# EAGLE design sqm-b411-7 (EAGLE 6.4)
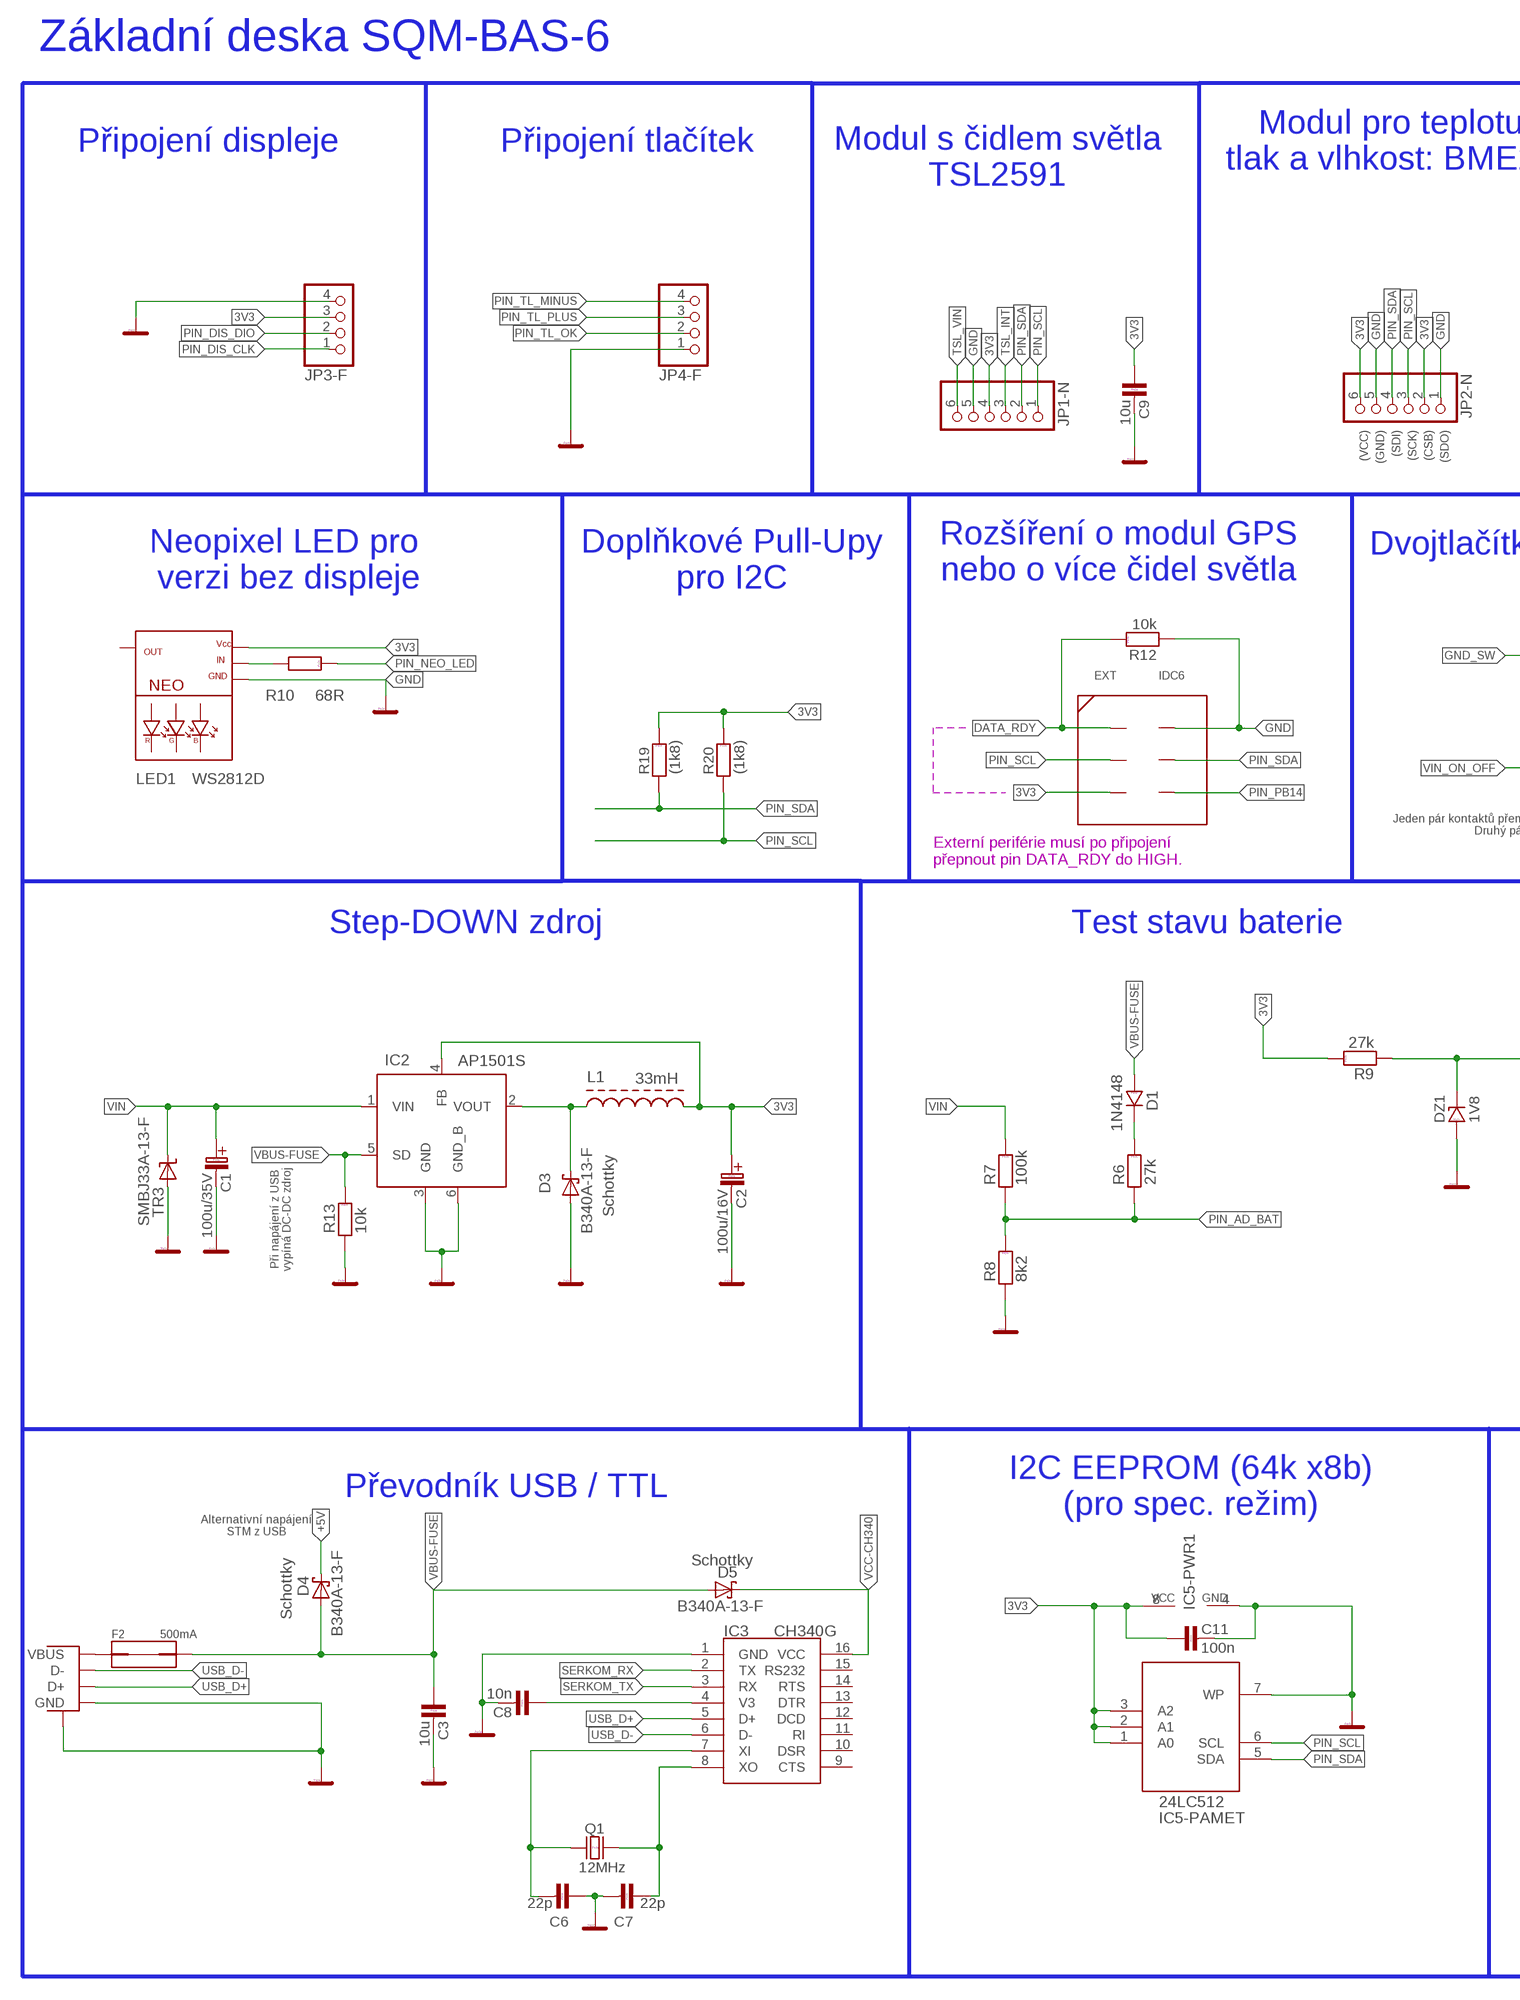
[diagram p0: schematic, sheet 1, part 1 of 2]
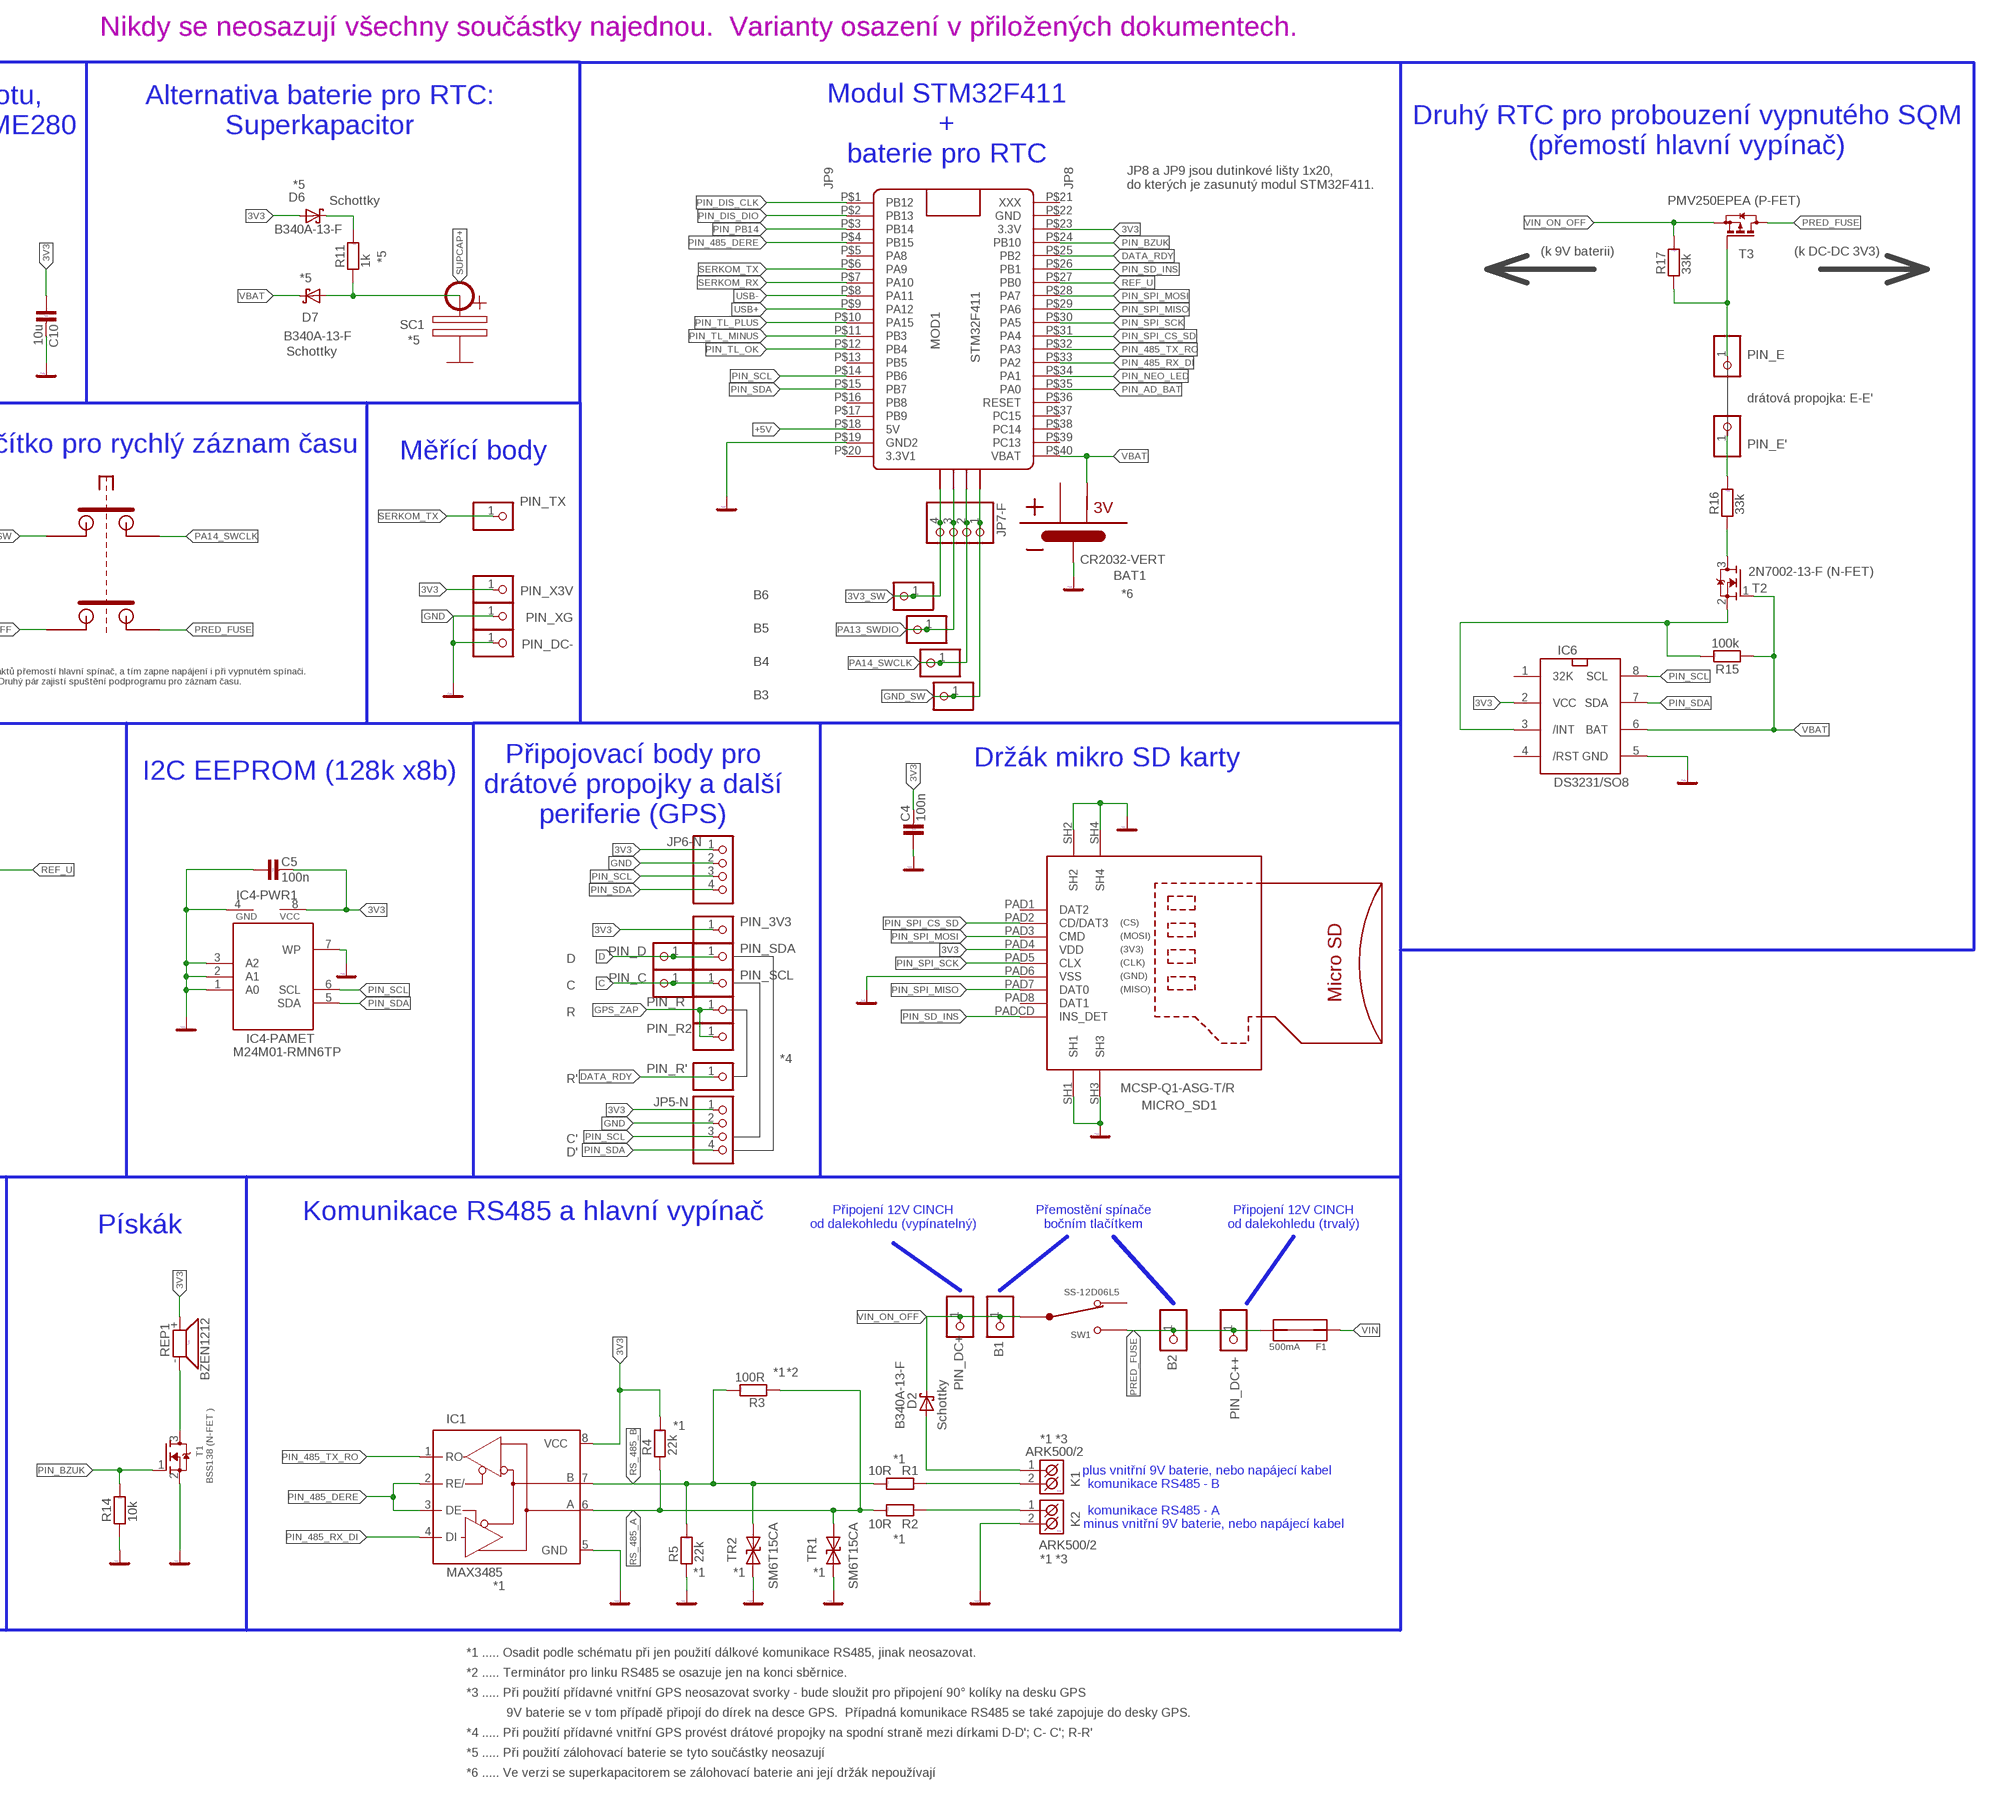
[diagram p1: schematic, sheet 1, part 2 of 2]

## Parts
B1  PINHD-1X1  [1X01]
B2  PINHD-1X1  [1X01]
B3  PINHD-1X1  [1X01]
B4  PINHD-1X1  [1X01]
B5  PINHD-1X1  [1X01]
B6  PINHD-1X1  [1X01]
BAT1  CR2032-VERT  [CR2032-VERT]
C1  100u/35V  C-ELEKTROLYT_3,5  [C-EL_3,5]
C2  100u/16V  C-ELEKTROLYT_3,5  [C-EL_3,5]
C3  10u  C-KERAMIK_SMD_0805  [0805]
C4  100n  C-KERAMIK_SMD_0805  [0805]
C5  100n  C-KERAMIK_SMD_0805  [0805]
C6  22p  C-KERAMIK_SMD_0805  [0805]
C7  22p  C-KERAMIK_SMD_0805  [0805]
C8  10n  C-KERAMIK_SMD_0805  [0805]
C9  10u  C-KERAMIK_SMD_0805  [0805]
C10  10u  C-KERAMIK_SMD_0805  [0805]
C11  100n  C-KERAMIK_SMD_0805  [0805]
D1  1N4148  1N4148_SOD80  [SOD-80]
D2  B340A-13-F  SCHOTTKY-DIODESMD  [SMB]
D3  B340A-13-F  SCHOTTKY-DIODESMD  [SMB]
D4  B340A-13-F  SCHOTTKY-DIODESMD  [SMB]
D5  B340A-13-F  SCHOTTKY-DIODESMD  [SMB]
D6  B340A-13-F  SCHOTTKY-DIODESMD  [SMB]
D7  B340A-13-F  SCHOTTKY-DIODESMD  [SMB]
DZ1  1V8  D-ZENEROVA_0,5W_BZV55C_SMD  [SOD-80]
EXT  IDC6  [IDC6]
F1  500mA  FUSE1812  [FUSE1812]
F2  500mA  FUSE1812  [FUSE1812]
IC1  MAX3485  MAX3468ESA  [SO08]
IC2  AP1501S  [TO263-5]
IC3  CH340G  [SOIC16]
IC4  M24M01-RMN6TP  EEPROM  [SO8]
IC5  24LC512  EEPROM  [SO8]
IC6  DS3231/SO8  RTC  [SO8]
JP1-N  PINHD-1X6  [1X06]
JP2-N  PINHD-1X6  [1X06]
JP3-F  PINHD-1X4  [1X04]
JP4-F  PINHD-1X4  [1X04]
JP5-N  PINHD-1X4  [1X04]
JP6-N  PINHD-1X4  [1X04]
JP7-F  PINHD-1X4  [1X04]
K1  ARK500/2  [ARK500/2]
K2  ARK500/2  [ARK500/2]
L1  33mH  SMD_INDUCTOR  [SMD_INDUCTOR]
LED1  WS2812D  LED_RGB  [LED_5-RGB]
MICRO_SD1  MCSP-Q1-ASG-T/R  MICRO_SD_MCSP_Q1_A_SG_T_R  [MICRO_SD]
MOD1  STM32F411  BLACK411_PILL  [BLACK411_PILL]
PIN_3V3  PINHD-1X1  [1X01]
PIN_C  PINHD-1X1  [1X01]
PIN_D  PINHD-1X1  [1X01]
PIN_DC+  PINHD-1X1  [1X01]
PIN_DC++  PINHD-1X1  [1X01]
PIN_DC-  PINHD-1X1  [1X01]
PIN_E  PINHD-1X1  [1X01]
PIN_E'  PINHD-1X1  [1X01]
PIN_R  PINHD-1X1  [1X01]
PIN_R2  PINHD-1X1  [1X01]
PIN_R'  PINHD-1X1  [1X01]
PIN_SCL  PINHD-1X1  [1X01]
PIN_SDA  PINHD-1X1  [1X01]
PIN_TX  PINHD-1X1  [1X01]
PIN_X3V  PINHD-1X1  [1X01]
PIN_XG  PINHD-1X1  [1X01]
Q1  12MHz  Q_HC-49U  [HC-49U]
R1  10R  R_1206  [1206]
R2  10R  R_1206  [1206]
R3  100R  R_SMD_0805  [0805]
R4  22k  R_SMD_0805  [0805]
R5  22k  R_SMD_0805  [0805]
R6  27k  R_SMD_0805  [0805]
R7  100k  R_SMD_0805  [0805]
R8  8k2  R_SMD_0805  [0805]
R9  27k  R_SMD_0805  [0805]
R10  68R  R_SMD_0805  [0805]
R11  1k  R_SMD_0805  [0805]
R12  10k  R_SMD_0805  [0805]
R13  10k  R_SMD_0805  [0805]
R14  10k  R_SMD_0805  [0805]
R15  100k  R_SMD_0805  [0805]
R16  33k  R_SMD_0805  [0805]
R17  33k  R_SMD_0805  [0805]
R19  (1k8)  R_SMD_0805  [0805]
R20  (1k8)  R_SMD_0805  [0805]
REP1  BZEN1212  KPE242  [KPE242]
SUPCAP-DIRA  DIRA  [DIRA]
SW1  SS-12D06L5  SLIDE_SW  [SLIDE_SW]
T1  BSS138 (N-FET )  MOSFET-NREFLOW  [SOT23]
T2  2N7002-13-F (N-FET)  MOSFET-NREFLOW  [SOT23]
T3  PMV250EPEA (P-FET)  BSS84  [SOT23]
TR1  SM6T15CA  SUPPRESSOR-  [SMBJ]
TR2  SM6T15CA  SUPPRESSOR-  [SMBJ]
TR3  SMBJ33A-13-F  SUPPRESSOR-SMBJ  [SMBJ]
USB1  USBPTH  [USB-B-PTH]

## Nets
3V3: C2.C+(C_EL+) C4.2 C5.2 C9.1 C10.1 C11.1 D6.A EXT.P5(PIN5) IC1.8(VCC) IC2.4(FB) IC4.8(-PWR1:VCC) IC5.1(-PAMET:A0) IC5.2(-PAMET:A1) IC5.3(-PAMET:A2) IC5.8(-PWR1:VCC) IC6.2(VCC) JP1-N.4 JP2-N.2 JP2-N.6 JP3-F.3 JP5-N.1 JP6-N.1 L1.P$2 LED1.V(VCC) MICRO_SD1.PAD4(VDD) MOD1.P$23(3.3V) PIN_3V3.1 PIN_X3V.1 R4.2 R9.2 R19.2 R20.2 REP1.+
3V3_SW: B6.1 JP7-F.4
+5V: D4.C MOD1.P$18(5V)
BZUK_DRAIN: REP1.- T1.3(D)
C: PIN_C.1 PIN_SCL.1
CH340-V3: C8.1 IC3.4(V3)
CHARGE: D6.C R11.2
D: PIN_D.1 PIN_SDA.1
D2-R6: D1.K R6.2
DATA_RDY: EXT.P1(PIN1) MOD1.P$25(PB2) PIN_R'.1 R12.2
DCDC-SW: D3.C IC2.2(VOUT) L1.P$1
E: PIN_E.1 R17.1 T3.1(G)
E'': PIN_E'.1 R16.2
GND: BAT1.MINUS C1.C-(C_EL-) C2.C-(C_EL-) C3.2 C4.1 C5.1 C6.1 C7.2 C8.2 C9.2 C10.2 C11.2 D3.A DZ1.A EXT.P2(PIN2) IC1.5(GND) IC2.3(GND) IC2.6(GND_B) IC3.1(GND) IC4.1(-PAMET:A0) IC4.2(-PAMET:A1) IC4.3(-PAMET:A2) IC4.4(-PWR1:GND) IC4.7(-PAMET:WP) IC5.4(-PWR1:GND) IC5.7(-PAMET:WP) IC6.5(GND) JP1-N.5 JP2-N.1 JP2-N.5 JP3-F.4 JP4-F.1 JP5-N.2 JP6-N.2 K2.2(K2) LED1.G(GND) MICRO_SD1.PAD6(VSS) MICRO_SD1.SH1 MICRO_SD1.SH2 MICRO_SD1.SH3 MICRO_SD1.SH4 MOD1.P$19(GND2) PIN_DC-.1 PIN_XG.1 R5.1 R8.1 R12.1 R13.1 R14.1 T1.2(S) TR1.A TR2.A TR3.A USB1.GND USB1.P$2(SHIELD)
GND_SW: B3.1 JP7-F.1
GPS_ZAP: PIN_R2.1 PIN_R.1
LED_RK: LED1.I(IN) R10.1
PA13_SWDIO: B5.1 JP7-F.3
PA14_SWCLK: B4.1 JP7-F.2
PIN_485_DERE: IC1.2(RE/) IC1.3(DE) MOD1.P$4(PB15)
PIN_485_RX_DI: IC1.4(DI) MOD1.P$33(PA2)
PIN_485_TX_RO: IC1.1(RO) MOD1.P$32(PA3)
PIN_AD_BAT: MOD1.P$35(PA0) R6.1 R7.1 R8.2
PIN_BZUK: MOD1.P$24(PB10) R14.2 T1.1(G)
PIN_DIS_CLK: JP3-F.1 MOD1.P$1(PB12)
PIN_DIS_DIO: JP3-F.2 MOD1.P$2(PB13)
PIN_NEO_LED: MOD1.P$34(PA1) R10.2
PIN_PB14: EXT.P6(PIN6) MOD1.P$3(PB14)
PIN_SCL: EXT.P3(PIN3) IC4.6(-PAMET:SCL) IC5.6(-PAMET:SCL) IC6.8(SCL) JP1-N.1 JP2-N.3 JP5-N.3 JP6-N.3 MOD1.P$14(PB6) R20.1
PIN_SD_INS: MICRO_SD1.PADCD(INS_DET) MOD1.P$26(PB1)
PIN_SDA: EXT.P4(PIN4) IC4.5(-PAMET:SDA) IC5.5(-PAMET:SDA) IC6.7(SDA) JP1-N.2 JP2-N.4 JP5-N.4 JP6-N.4 MOD1.P$15(PB7) R19.1
PIN_SPI_CS_SD: MICRO_SD1.PAD2(CD/DAT3) MOD1.P$31(PA4)
PIN_SPI_MISO: MICRO_SD1.PAD7(DAT0) MOD1.P$29(PA6)
PIN_SPI_MOSI: MICRO_SD1.PAD3(CMD) MOD1.P$28(PA7)
PIN_SPI_SCK: MICRO_SD1.PAD5(CLX) MOD1.P$30(PA5)
PIN_TL_MINUS: JP4-F.4 MOD1.P$11(PB3)
PIN_TL_OK: JP4-F.2 MOD1.P$12(PB4)
PIN_TL_PLUS: JP4-F.3 MOD1.P$10(PA15)
PRED_FUSE: B2.1 F1.P$1 PIN_DC++.1 SW1.PIN_2 T3.3(D)
REF_U: DZ1.K MOD1.P$27(PB0) R9.1
RS485-A-IN: K2.1(K1) R2.1
RS485-B-IN: K1.2(K2) R1.1
RS_485_A: IC1.6(A) R2.2 R3.1 R4.1 TR1.C
RS_485_B: IC1.7(B) R1.2 R3.2 R5.2 TR2.C
RTC_INT: IC6.3(/INT) R15.2 T2.2(S)
SERKOM_RX: IC3.2(TX) MOD1.P$7(PA10)
SERKOM_TX: IC3.3(RX) MOD1.P$6(PA9) PIN_TX.1
SUPCAP+: D7.A R11.1 SUPCAP-DIRA.P$1
T2_DRAIN: R16.1 T2.3(D)
TSL_INT: JP1-N.3
TSL_VIN: JP1-N.6
UBAT: D2.A K1.1(K1)
USB+: MOD1.P$9(PA12)
USB-: MOD1.P$8(PA11)
USB_D+: IC3.5(D+) USB1.D+
USB_D-: IC3.6(D-) USB1.D-
V-USB-IN: F2.P$2 USB1.VBUS
VBAT: BAT1.PLUS2 D7.C IC6.6(BAT) MOD1.P$40(VBAT) R15.1 T2.1(G)
VBUS-FUSE: C3.1 D1.A D4.A D5.A F2.P$1 IC2.5(SD) R13.2
VCC-CH340: D5.C IC3.16(VCC)
VIN: C1.C+(C_EL+) F1.P$2 IC2.1(VIN) R7.2 TR3.C
VIN_ON_OFF: B1.1 D2.C PIN_DC+.1 R17.2 SW1.PIN_COM T3.2(S)
XI: C6.2 IC3.7(XI) Q1.1
XO: C7.1 IC3.8(XO) Q1.2
Unconnected: BAT1.PLUS1 IC3.9(CTS) IC3.10(DSR) IC3.11(RI) IC3.12(DCD) IC3.13(DTR) IC3.14(RTS) IC3.15(RS232) IC6.1(32K) IC6.4(/RST) LED1.O(OUT) MICRO_SD1.PAD1(DAT2) MICRO_SD1.PAD8(DAT1) MOD1.P$5(PA8) MOD1.P$13(PB5) MOD1.P$16(PB8) MOD1.P$17(PB9) MOD1.P$20(3.3V1) MOD1.P$22(GND) MOD1.P$36(RESET) MOD1.P$37(PC15) MOD1.P$38(PC14) MOD1.P$39(PC13) SW1.PIN_1

## Notes on the sheet
- Základní deska SQM-BAS-6 | Nikdy se neosazují všechny součástky najednou.  Varianty osazení v přiložených dokumentech.
- Připojení displeje | Připojení tlačítek
- Modul pro teplotu, 
  tlak a vlhkost: BME280
- Alternativa baterie pro RTC:
  Superkapacitor
- Modul s čidlem světla
  TSL2591
- Modul STM32F411
  +
  baterie pro RTC
- Druhý RTC pro probouzení vypnutého SQM
  (přemostí hlavní vypínač)
- *5 | JP9 | JP8
- JP8 a JP9 jsou dutinkové lišty 1x20,
  do kterých je zasunutý modul STM32F411.
- Schottky
- (k 9V baterii) | (k DC-DC 3V3)
- *5
- *5
- SC1
- *5
- (VCC) | (GND) | (SDI) | (SCK) | (CSB) | (SDO)
- Schottky
- drátová propojka: E-E'
- Dvojtlačítko pro rychlý záznam času
- Rozšíření o modul GPS
  nebo o více čidel světla
- Měřící body
- Neopixel LED pro 
  verzi bez displeje
- Doplňkové Pull-Upy
  pro I2C
- *6
- Jeden pár kontaktů přemostí hlavní spínač, a tím zapne napájení i při vypnutém spínači.
  Druhý pár zajistí spuštění podprogramu pro záznam času.
- Externí periférie musí po připojení
  přepnout pin DATA_RDY do HIGH.
- Step-DOWN zdroj | Test stavu baterie | Držák mikro SD karty
- I2C EEPROM (128k x8b)
- Připojovací body pro
  drátové propojky a další
  periferie (GPS)
- Schottky
- D
- C
- Při napájení z USB
  vypíná DC-DC zdroj
- R
- *4
- R'
- C'
- D'
- Komunikace RS485 a hlavní vypínač
- Připojení 12V CINCH
  od dalekohledu (vypínatelný)
- Přemostění spínače
  bočním tlačítkem
- Připojení 12V CINCH
  od dalekohledu (trvalý)
- Převodník USB / TTL
- I2C EEPROM (64k x8b)
  (pro spec. režim)
- Pískák
- Alternativní napájení
  STM z USB
- Schottky
- Schottky
- *1 | *2
- *1 | Schottky
- *1 *3
- *1
- plus vnitřní 9V baterie, nebo napájecí kabel
- komunikace RS485 - B
- komunikace RS485 - A
- minus vnitřní 9V baterie, nebo napájecí kabel
- *1
- *1 *3
- *1 | *1 | *1
- *1
- *1 ..... Osadit podle schématu při jen použití dálkové komunikace RS485, jinak neosazovat.
- *2 ..... Terminátor pro linku RS485 se osazuje jen na konci sběrnice.
- *3 ..... Při použití přídavné vnitřní GPS neosazovat svorky - bude sloužit pro připojení 90° kolíky na desku GPS
- 9V baterie se v tom případě připojí do dírek na desce GPS.  Případná komunikace RS485 se také zapojuje do desky GPS.
- *4 ..... Při použití přídavné vnitřní GPS provést drátové propojky na spodní straně mezi dírkami D-D'; C- C'; R-R'
- *5 ..... Při použití zálohovací baterie se tyto součástky neosazují
- *6 ..... Ve verzi se superkapacitorem se zálohovací baterie ani její držák nepoužívají

## Power pins joined to a net without a drawn wire
XXX: MOD1.P$21(XXX)

## Library data of the parts
B1-B6 PIN_3V3 PIN_C PIN_D PIN_DC+ PIN_DC++ PIN_DC- PIN_E PIN_E' PIN_R PIN_R2 PIN_R' PIN_SCL PIN_SDA PIN_TX PIN_X3V PIN_XG = pinhead:PINHD-1X1: PIN HEADER
BAT1 = cr2032-vert:CR2032-VERT: Vertikální držák pro CR2032
C1 C2 = #PaJa_30:C-ELEKTROLYT: Kondenzator - elektrolyticky
C3-C11 = #PaJa_30:C-KERAMIK: Kondenzator - keramicky
D1 = #PaJa_30:1N4148: Univerzalni dioda - 0,15A, 75V
D2-D7 = diode:SCHOTTKY-DIODE: Schottky Diode
DZ1 = #PaJa_30:D-ZENEROVA: Zenerova dioda
EXT = idc6:IDC6
F1 F2 = fuse1812:FUSE1812
IC1 = maxim:MAX34*: +5V, Fail-Safe, 40Mbps, Profibus RS-485/RS-422 Transceivers Source: MAX3465-MAX3469.pdf; MPN: MAX3468ESA+T; OC_FARNELL: unknown; OC_NEWARK: 76K6724
IC2 = AP1501:AP1501: AP1501 - Step-Down driver
IC3 = usb-serial:CH340G
IC4 IC5 = eeprom:EEPROM: EEPROM
IC6 = ds3231_SO8:RTC: RTC DS3231 SO8
JP1-N JP2-N = pinhead:PINHD-1X6: PIN HEADER
JP3-F JP4-F JP5-N JP6-N JP7-F = pinhead:PINHD-1X4: PIN HEADER
K1 K2 = #PaJa_konektory:ARK500/2: Svorkovnice - roztec 5mm - dvojita
L1 = SMD_inductor:SMD_INDUCTOR
LED1 = Neopixel_THT:LED_RGB: LED dioda - RGB - Neopixel - 4 vyvody O-V-G-I
MICRO_SD1 = micro_SD:MICRO_SD_MCSP_Q1_A_SG_T_R: Micro SD card holder
MOD1 = BP411:BLACK411_PILL: Modul STM32F411 (BlackBill)
Q1 = #PaJa_30:Q_HC-49U: Krystal - 1MHz - 48MHz
R1 R2 = #PaJa_31:R: Rezistor
R3-R17 R19 R20 = #PaJa_30:R: Rezistor
REP1 = tuk_bzuk_6,6_14:KPE242: Piezo-sirenka - 70dB - 3V az 16V
SUPCAP-DIRA = dira:DIRA
SW1 = SLIDE_SW:SLIDE_SW: Posuvny prepinac
T1 T2 = adafruit-orig:MOSFET-N: N-Channel Mosfet 2N7002E - 60V 260mA SOT23 [Digikey: 2N7002ET1GOSTR-ND] - REEL BSH103 - 30V 850mA SOT23 [Digikey: 568-5013-1-ND]
T3 = transistor-small-signal:BSS84: P-CHANNEL MOS FET
TR1 TR2 = obousmerny_transil:SUPPRESSOR-: Obousmerny transil
TR3 = diode:SUPPRESSOR-: Suppressor diode
USB1 = USB-B:USB: USB Connectors USB-B-PTH is fully proven SKU : PRT-00139 USB-miniB is fully proven SKU : PRT-00587 USB-A-PCB is untested. USB-A-H is C@H proven USB-B-SMT is throughly reviewed, but untested. Needs silkscreen touching up. USB-A-S has not been used/tested USB-MB-H has not been used/tested

## Board
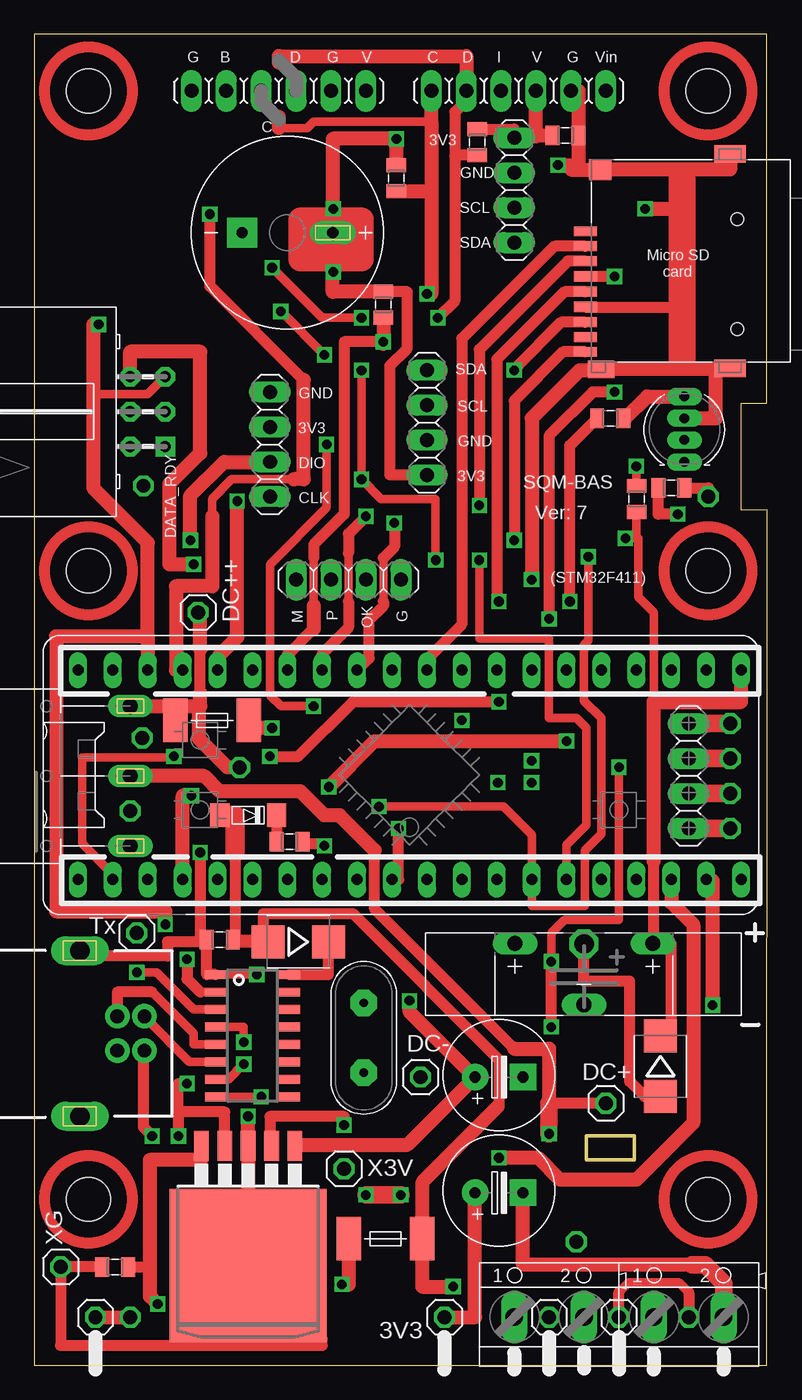
[diagram p2: board, top side]
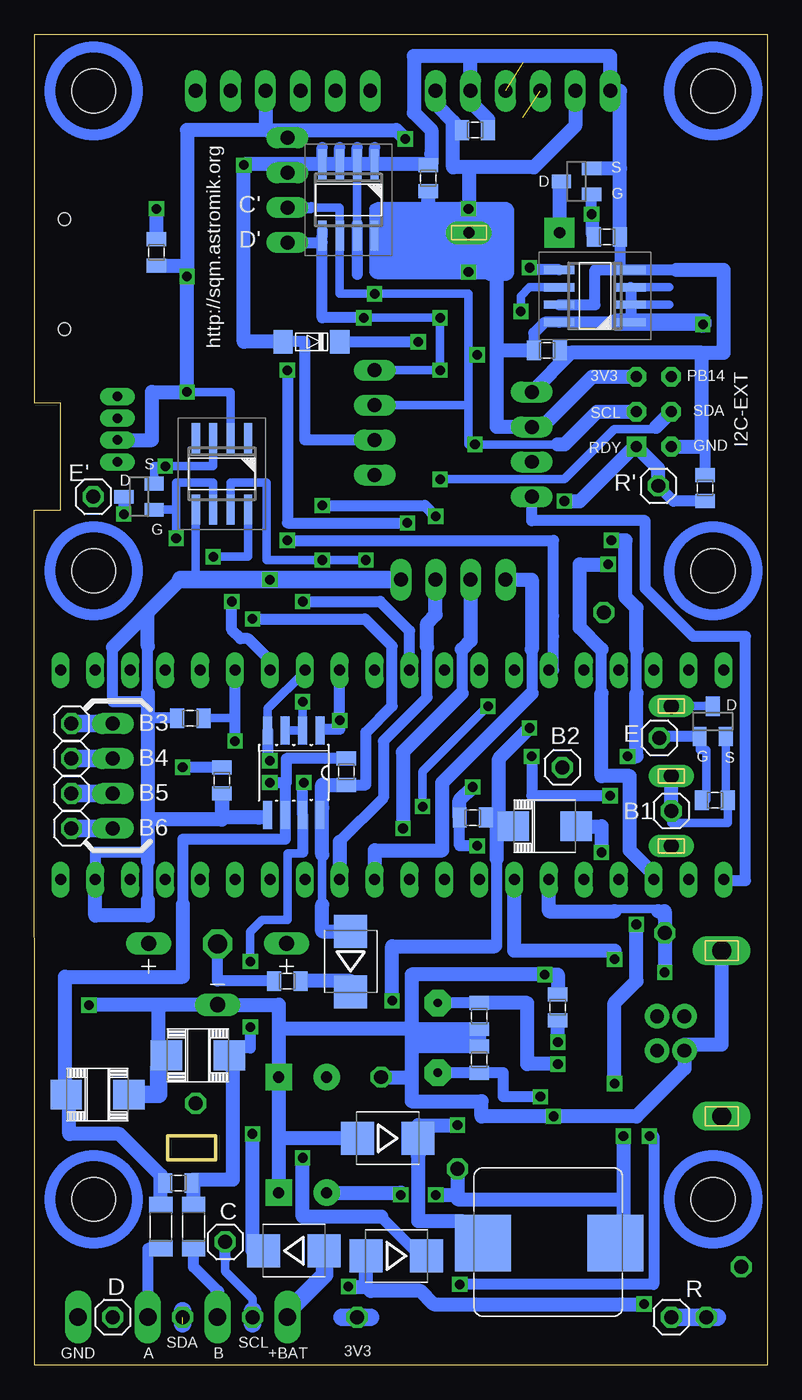
[diagram p3: board, bottom side, seen from below]

Size 53.34 x 96.83 mm. Coordinates in mm from the lower left corner, seen from the top.
Outline: 0,0 53.32,0 53.34,62.23 51.44,62.23 51.44,70.01 53.32,70.01 53.32,96.83 0,96.83 0,0
Copper layers (1*16): Top 0.035mm / dielectric 1.5mm / Bottom 0.035mm
Design rules "default *": minimum track width 10mil, minimum drill 24mil, track to track 8mil, track to pad 8mil, pad to pad 8mil, via to via 8mil, smd to smd 8mil, copper to edge 40mil, drill to drill 8mil, minimum pad ring 10mil, minimum via ring 8mil, stop-mask expansion 4mil, vias tented up to drill 0mil, thermal gap 10mil
Holes 3.2 mm at 49.02,57.78 3.94,92.71 49.02,92.71 3.94,57.78 3.94,12.06 49.02,12.06
Milling: 4 lines

### Footprints (pad centres in the part's own frame; a part is rotated, then mirrored left to right if it is on the bottom)
1X01 = drill 1.016 octagon: 1 0,0
CR2032-VERT = drill 1.1 long: MINUS 0,-2.032; PLUS1 -5.016,2.413; PLUS2 5.016,2.413
C-EL_3,5 = drill 0.813 pad 1.93: C+ 0,0 | drill 0.813 pad 1.93 square: C- 3.493,0
0805 = smd 1.016 x 1.422: 1 -0.953,0; 2 0.953,0
SOD-80 = smd 1.397 x 1.702: A 1.905,0; K -2.223,0
SMB = smd 2.4 x 2.4: A 2.2,0; C -2.2,0
IDC6 = drill 0.8 pad 1.422 square: P1 -2.54,-2.54 | drill 0.8 pad 1.422 octagon: P2 -2.54,0; P3 0,-2.54; P4 0,0; P5 2.54,-2.54; P6 2.54,0
FUSE1812 = smd 1.778 x 3.15: P$1 -2.667,0; P$2 2.667,0
SO08 = smd 0.66 x 2.032: 1 -1.905,-3.073; 2 -0.635,-3.073; 3 0.635,-3.073; 4 1.905,-3.073; 5 1.905,3.073; 6 0.635,3.073; 7 -0.635,3.073; 8 -1.905,3.073
TO263-5 = smd 1.067 x 2.159: 1 -3.404,-5.791; 2 -1.702,-5.791; 3 0,-5.791; 4 1.702,-5.791; 5 3.404,-5.791 | smd 11.43 x 11.176: 6 0,2.921
SOIC16 = smd 0.635 x 1.524: 1 -4.445,-2.695; 2 -3.175,-2.695; 3 -1.905,-2.695; 4 -0.635,-2.695; 5 0.635,-2.695; 6 1.905,-2.695; 7 3.175,-2.695; 8 4.445,-2.695; 9 4.445,2.695; 10 3.175,2.695; 11 1.905,2.695; 12 0.635,2.695; 13 -0.635,2.695; 14 -1.905,2.695; 15 -3.175,2.695; 16 -4.445,2.695
SO8 = smd 0.6 x 2.2: 1 -1.905,-2.6; 2 -0.635,-2.6; 3 0.635,-2.6; 4 1.905,-2.6; 5 1.905,2.6; 6 0.635,2.6; 7 -0.635,2.6; 8 -1.905,2.6
1X06 = drill 1.016 long: 1 -6.35,0; 2 -3.81,0; 3 -1.27,0; 4 1.27,0; 5 3.81,0; 6 6.35,0
1X04 = drill 1.016 long: 1 -3.81,0; 2 -1.27,0; 3 1.27,0; 4 3.81,0
ARK500/2 = drill 1.27 pad 1.93 long: 1 -2.54,0; 2 2.54,0
SMD_INDUCTOR = smd 4.089 x 4.089: P$1 -4.826,0; P$2 4.826,0
LED_5-RGB = drill 0.7 pad 1.27 long: G 0.635,0; I 2.223,0; O -2.54,0; V -0.953,0
MICRO_SD = smd 0.711 x 1.676: PAD1 2.159,7.684; PAD2 1.079,7.684; PAD3 0,7.684; PAD5 -2.223,7.684; PAD7 -4.445,7.684; PAD8 -5.524,7.684; PADCD -6.604,7.684 | smd 0.762 x 1.676: PAD4 -1.111,7.684; PAD6 -3.334,7.684 | smd 1.27 x 1.905: SH1 -7.874,6.54 | smd 1.524 x 1.651: SH2 6.668,6.604 | smd 1.27 x 2.286: SH3 -7.811,-2.857; SH4 7.811,-2.857 | hole 0.9: -4.953,-3.365; 3.048,-3.365
BLACK411_PILL = drill 0.8 long: P$1 -7.62,15.24; P$2 -7.62,12.7; P$3 -7.62,10.16; P$4 -7.62,7.62; P$5 -7.62,5.08; P$6 -7.62,2.54; P$7 -7.62,0; P$8 -7.62,-2.54; P$9 -7.62,-5.08; P$10 -7.62,-7.62; P$11 -7.62,-10.16; P$12 -7.62,-12.7; P$13 -7.62,-15.24; P$14 -7.62,-17.78; P$15 -7.62,-20.32; P$16 -7.62,-22.86; P$17 -7.62,-25.4; P$18 -7.62,-27.94; P$19 -7.62,-30.48; P$20 -7.62,-33.02; P$21 7.62,15.24; P$22 7.62,12.7; P$23 7.62,10.16; P$24 7.62,7.62; P$25 7.62,5.08; P$26 7.62,2.54; P$27 7.62,0; P$28 7.62,-2.54; P$29 7.62,-5.08; P$30 7.62,-7.62; P$31 7.62,-10.16; P$32 7.62,-12.7; P$33 7.62,-15.24; P$34 7.62,-17.78; P$35 7.62,-20.32; P$36 7.62,-22.86; P$37 7.62,-25.4; P$38 7.62,-27.94; P$39 7.62,-30.48; P$40 7.62,-33.02
HC-49U = drill 0.61 pad 1.93 octagon: 1 -2.54,0; 2 2.54,0
1206 = smd 1.143 x 1.702: 1 -1.587,0; 2 1.587,0
KPE242 = drill 0.813 pad 1.676 long: + -3.302,0 | drill 0.813 pad 2.184 square: - 3.302,0
DIRA = drill 1.4 pad 1.905 octagon: P$1 0,0
SLIDE_SW = drill 1.1 long: PIN_1 -5.08,-7.62; PIN_2 5.08,-7.62; PIN_COM 0,-7.62
SOT23 = smd 1 x 1.4: 1 -0.95,-1.1; 2 0.95,-1.1; 3 0,1.1
SMBJ = smd 2.286 x 2.16: A 2.294,0; C -2.284,0
USB-B-PTH = drill 1 pad 1.778: D+ 0,1.25; D- 1.981,1.25; GND 0,-1.25; VBUS 1.981,-1.25 | drill 1.4 long: P$2 -2.718,6.02; SHIELD -2.718,-6.02

### Placement (x,y rotation side)
B1  6.99,40.32 0 bottom
B2  14.92,43.5 0 bottom
B3  50.64,46.67 0 bottom
B4  50.64,44.13 0 bottom
B5  50.64,41.59 0 bottom
B6  50.64,39.05 0 bottom
BAT1  40.01,28.26 0 top
C1  32.07,20.95 0 top
C2  32.07,12.54 0 top
C3  13.49,30.96 180 top
C4  44.45,80.96 270 bottom
C5  24.69,86.36 270 bottom
C6  20.95,25.4 90 bottom
C7  20.95,22.23 90 bottom
C8  15.24,26.04 90 bottom
C9  38.66,89.46 0 top
C10  21.27,89.85 0 bottom
C11  16.03,73.82 0 bottom
D1  15.4,40.01 180 top
D2  34.45,8.33 0 bottom
D3  27.62,16.51 180 bottom
D4  26.99,7.94 180 bottom
D5  19.21,30.8 180 top
D6  30.32,29.37 90 bottom
D7  45.56,21.75 270 top
DZ1  33.34,74.45 180 bottom
EXT  6.99,69.37 90 top
F1  12.94,46.91 0 top
F2  25.56,9.21 180 top
IC1  34.45,43.1 180 bottom
IC2  15.56,10.16 180 top
IC3  15.88,23.97 270 top
IC4  30.48,84.77 180 bottom
IC5  12.54,77.79 90 bottom
IC6  39.69,64.85 180 bottom
JP1-N  35.24,92.71 0 top
JP2-N  17.78,92.71 0 top
JP3-F  17.14,66.99 90 top
JP4-F  22.86,57.15 180 top
JP5-N  34.92,85.49 270 top
JP6-N  28.57,68.58 90 top
JP7-F  47.62,42.86 270 top
K1  37.47,3.49 0 top
K2  47.62,3.49 0 top
L1  15.88,8.89 0 bottom
LED1  47.31,68.26 90 top
MICRO_SD1  47.78,80.33 90 top
MOD1  18.41,42.94 90 top
PIN_3V3  29.84,3.49 0 top
PIN_C  39.45,8.97 0 bottom
PIN_D  47.62,3.49 0 bottom
PIN_DC+  41.59,19.05 0 top
PIN_DC++  11.91,54.77 0 top
PIN_DC-  28.1,20.95 0 top
PIN_E  7.86,45.64 0 bottom
PIN_E'  49.05,63.18 0 bottom
PIN_R  6.99,3.49 0 bottom
PIN_R2  4.45,3.49 0 top
PIN_R'  7.94,63.98 0 bottom
PIN_SCL  37.47,3.49 0 top
PIN_SDA  42.55,3.49 0 top
PIN_TX  7.46,31.43 0 top
PIN_X3V  22.54,14.29 0 top
PIN_XG  1.91,7.14 0 top
Q1  23.97,23.81 270 top
R1  41.75,10.08 90 bottom
R2  44.13,10.08 90 bottom
R3  42.86,13.26 0 bottom
R4  30.64,43.18 270 bottom
R5  39.69,42.55 90 bottom
R6  18.57,38.1 180 top
R7  21.43,39.85 0 bottom
R8  41.99,47.07 0 bottom
R9  25.4,77.15 90 top
R10  41.91,68.9 180 top
R11  34.92,27.94 0 bottom
R12  4.52,63.82 270 bottom
R13  5.87,7.14 0 top
R14  11.67,82.07 180 bottom
R15  43.81,63.02 90 top
R16  46.35,63.82 0 top
R17  3.81,41.12 0 bottom
R19  32.23,88.98 90 top
R20  26.35,86.36 90 top
REP1  18.41,82.39 180 top
SUPCAP-DIRA  40.01,30.64 0 top
SW1  -0.64,42.86 90 top
T1  13.89,86.12 90 bottom
T2  45.72,63.18 90 bottom
T3  3.97,46.83 0 bottom
TR1  48.74,19.68 0 bottom
TR2  41.43,22.54 180 bottom
TR3  16.19,39.21 0 bottom
USB1  6.03,24.13 0 top

### Tracks (layer width: path | path; a pad name or v marks a point on that pad's centre or on a via)
3V3  (via drill 0.7)
  Top 0.61: 4.29,70.56 4.29,70.64 8.26,70.64 EXT.P5
  Top 0.813: IC2.4 13.86,18.41 10.48,18.41 | 10.48,18.41 v10.48,16.67 | 10.48,18.41 10.48,20.48 v11.11,20.48 | MICRO_SD1.PAD4 v42.23,79.22 | v42.23,70.8 40.64,70.8 37.47,67.63 v37.47,54.29 | R9.2 27.15,78.11 27.15,73.98 25.88,72.71 25.88,64.77 JP6-N.1 | R19.2 34.92,89.93 JP5-N.1 36.51,89.3 36.51,89.46
  Top 1.016: 8.26,53.02 8.26,59.85 4.29,63.82 4.29,70.56 4.29,75.72 v4.68,75.72 | R20.2 v26.35,89.22 21.72,89.22 REP1.+ 21.72,78.11 R9.2 | 8.26,53.02 1.59,53.02 1.59,33.02 9.53,33.02 v9.53,32.07 | C9.1 36.51,89.46 JP1-N.4 | PIN_3V3.1 32.07,3.49 C2.C+ | 8.26,53.02 MOD1.P$23
  Top 1.27: v26.67,12.38 v24.13,12.38
  Top 1.778: 21.72,83.34 23.81,83.34 23.81,80.49 19.37,80.49 19.37,82.07 | 19.37,82.07 19.37,83.34 21.72,83.34 | 19.37,82.07 23.5,82.07 | 21.72,83.34 REP1.+
  Bottom 0.254: 28.26,83.98 28.57,83.98 28.57,83.19
  Bottom 0.406: 32.38,40.27 32.38,40.56
  Bottom 0.61: 10.48,8.89 L1.P$2 | 42.55,80.01 42.23,80.01 v42.23,79.22 | 32.38,33.5 32.38,37.15 | 10,75.88 7.14,75.88 | 7.14,77.15 IC5.2 10,77.15 | 7.14,78.42 IC5.3 10,78.42 | IC1.8 32.38,40.19 32.38,40.56 | IC6.2 39.05,70.8 v42.23,70.8
  Bottom 0.813: R4.2 29.21,42.23 29.21,46.04 27.3,47.94 27.3,52.31 29.29,54.29 v37.47,54.29 | C5.2 24.77,85.41 24.77,84.14 28.57,84.14 28.57,83.19 IC4.8 28.57,79.53 28.42,79.53 | 31.91,12.54 C2.C+ | IC5.3 IC5.2 IC5.1 10,75.88 10.95,75.88 IC5.8 16.19,75.88 16.99,75.09 C11.1
  Bottom 1.016: v10.48,16.67 10.48,12.06 | 10.48,12.06 10.48,8.89 | 31.91,12.54 26.67,12.54 v26.67,12.38 | v24.13,12.38 22.54,12.38 | 22.54,12.38 22.54,12.06 10.48,12.06 | v11.11,20.48 11.11,26.35 9.53,27.94 v9.53,32.07 | 28.42,79.53 v21.75,79.53 19.68,79.53 19.68,73.82 | JP2-N.2 13.97,90.17 16.99,87.15 21.72,87.15 | 21.72,87.15 22.86,87.15 22.86,90.49 | JP1-N.4 36.51,89.85 | 36.51,89.85 42.23,89.85 v42.23,79.22 v42.23,70.8 44.77,70.8 44.77,67.31 LED1.V | 19.68,73.82 19.68,68.26 JP3-F.3 16.38,68.26 12.73,71.91 EXT.P5 | 36.51,89.85 26.99,89.85 v26.35,89.22 | C4.2 42.55,80.01 | PIN_X3V.1 22.54,12.38 | D6.A 32.38,31.57 32.38,33.5 | 32.38,37.15 32.38,40.56 32.38,42.23 R4.2 | C5.2 24.69,84.14 v21.75,84.14 21.72,84.14 REP1.+ 21.72,87.15 | 22.86,90.49 23.97,91.6 23.97,92.55 JP2-N.6 | C10.1 22.86,90.49 | C11.1 19.68,73.82
  Bottom 1.27: 28.26,80.17 19.05,80.17 | 19.05,80.17 19.05,81.6 | 19.05,81.6 19.05,83.98 27.94,83.98 | 27.94,83.98 27.94,81.12 24.92,81.12 24.92,83.03 26.99,83.03 26.99,81.76 25.88,81.76 25.88,82.71 | 19.21,81.6 19.05,81.6 | 19.05,80.17 19.05,79.53 20.16,79.53 20.16,80.33 | 25.88,81.6 28.26,81.6 28.26,83.98 27.94,83.98 | 30.96,3.49 PIN_3V3.1 28.89,3.49 | v4.68,75.72 4.68,75.88 10.95,75.88
  Bottom 1.778: 21.72,80.49 19.37,80.49 19.37,81.76 | 23.81,81.76 23.81,80.49 21.72,80.49 | 23.81,81.76 23.81,83.34 19.37,83.34 19.37,81.76 | 19.37,81.76 23.81,81.76 | 21.72,80.49 REP1.+
3V3_SW
  Top 1.27: JP7-F.4 B6.1
  Bottom 1.27: JP7-F.4 B6.1
+5V  (via drill 0.7)
  Top 1.016: v33.81,15.08 36.67,15.08 38.26,13.49 43.81,13.49 47.94,17.62 47.94,32.07 46.35,33.66 MOD1.P$18
  Bottom 0.813: 28.1,10.79 24.61,7.3 24.47,7.3
  Bottom 1.016: 28.1,10.79 33.81,10.79 v33.81,15.08 | 24.61,7.3 24.61,7.76 D4.C
BZUK_DRAIN
  Bottom 1.016: 15.08,82.39 REP1.- 15.11,86.12 T1.3
C
  Bottom 0.61: 37.47,3.97 37.47,4.84 39.45,6.83 39.45,7.78
  Bottom 0.813: 39.45,7.78 PIN_C.1
  Bottom 1.27: 37.47,3.02 PIN_SCL.1 37.47,3.97
CH340-V3  (via drill 0.7)
  Top 0.61: IC3.4 15.24,24.61 v15.24,23.5
  Bottom 1.016: v15.24,23.5 C8.1
CHARGE
  Bottom 0.813: D6.C 30.32,27.94
  Bottom 1.016: 30.32,27.94 R11.2
D  (1 unrouted)
  Top 0.61: 42.55,5.32 43.26,6.03 46.91,6.03 47.62,5.32
  Top 0.813: PIN_SDA.1 42.55,5.32 | 47.62,5.32 PIN_D.1
  Bottom 1.27: 42.55,3.02 42.55,3.97
D2-R6
  Top 0.813: D1.K R6.2
DATA_RDY  (via drill 0.7)
  Top 1.016: v14.76,62.87 14.76,52.94 13.41,51.59 13.41,50.56 MOD1.P$25
  Bottom 0.813: R12.2 6.83,62.87 PIN_R'.1
  Bottom 1.016: v14.76,62.87 13.65,62.87 9.68,66.83 EXT.P1 7.94,65.25 PIN_R'.1
DCDC-SW  (via drill 0.7)
  Top 0.61: 17.14,15.95 IC2.2
  Top 0.813: 17.14,15.95 17.14,18.1 22.54,18.1 v22.54,17.46
  Bottom 0.61: L1.P$1 22.23,8.89 22.23,10.48
  Bottom 1.016: 22.23,10.48 25.4,10.48 25.4,15.24 | v22.54,17.46 25.4,17.46 25.4,15.24 | 25.4,15.24 25.42,15.26 D3.C
E
  Bottom 0.61: R17.1 4.45,41.12 4.45,44.77 4.92,44.77 T3.1
  Bottom 0.813: T3.1 7.86,45.73 PIN_E.1
E''
  Top 0.813: R16.2 49.05,63.82 PIN_E'.1
GND  (via drill 0.7)
  Top 0.61: IC3.1 v16.19,28.42 | 39.69,87 MICRO_SD1.SH2 | MICRO_SD1.SH3 50.64,72.45 | 39.69,72.39 46.67,72.39 46.67,72.55 | 46.51,76.99 46.67,77.15
  Top 0.813: IC3.1 12.54,28.42 12.54,30.8 12.06,30.8 | 12.06,30.8 9.68,30.8 9.68,29.77 3.33,29.77 3.33,30.15 USB1.P$2 | IC2.6 15.56,1.91 20.95,1.91 20.95,1.43 1.91,1.43 PIN_XG.1 R13.1 | MICRO_SD1.PAD6 46.51,76.99 | v12.06,37.31 12.06,30.8 | 49.37,35.24 48.9,35.24 MOD1.P$19 | 39.05,87 39.61,87 39.61,87.31
  Top 1.016: IC2.6 IC2.3 v15.56,18.1 | MICRO_SD1.SH4 50.64,87 47.62,87 | 46.67,87 MICRO_SD1.SH2 39.05,87 | JP1-N.5 39.61,92.71 C9.2 39.61,87.31 v38.1,87.31 | 50.64,72.45 49.61,72.45 | 49.61,72.45 MICRO_SD1.SH1 | 46.67,72.55 46.67,77.15 46.67,84.14 | 46.67,84.14 46.67,87 | v36.2,57.15 36.2,68.9 39.69,72.39 41.24,72.39 MICRO_SD1.SH1 | v44.45,84.14 46.67,84.14 | 47.86,7.3 35.56,7.3 C2.C- | v49.37,26.19 49.37,35.24 | C3.2 12.54,30.8 | MICRO_SD1.SH1 41.27,72.45 41.27,72.55 | 47.62,72.47 47.62,87 | 47.62,87 46.67,87 | LED1.G 49.61,68.9 49.61,72.45
  Top 1.27: 47.86,7.3 48.82,7.3 50.16,5.95 K2.2
  Bottom 0.406: 24.45,88.11 24.69,88.11 C5.1
  Bottom 0.61: 11.11,92.71 JP2-N.1 | IC4.7 29.84,83.03 IC4.2 | v36.2,57.15 41.59,57.15 IC6.5 | IC1.5 36.99,40.03 36.99,39.85
  Bottom 0.813: 45.09,36.67 45.09,33.81 | R14.1 10.72,79.69 | 10.72,79.69 IC5.4 6.59,79.69 | 29.84,83.03 29.84,79.38 | IC4.1 28.57,88.58 | IC4.3 31.11,88.58 | IC4.4 32.38,88.58 | IC4.2 29.84,88.58 | DZ1.A 33.66,74.45 33.66,67.31 JP6-N.2 | IC5.7 12.54,77.15 12.54,79.69 10.72,79.69 | R12.1 4.52,66.83 4.76,66.83 | 45.09,37.31 48.9,37.31 48.9,35.16 | R8.1 45.01,47.07 45.01,48.26 47.62,48.26 47.62,52.23 | 45.09,48.9 45.09,52.31 | JP5-N.2 34.92,87.37
  Bottom 1.016: 35.56,16.51 C1.C- 35.56,24.45 | 35.56,16.51 C2.C- | 25.88,24.45 25.88,28.42 v16.19,28.42 15.24,28.42 C8.2 | 25.88,24.45 C6.1 C7.2 21.27,23.18 | 35.56,24.45 35.56,26.23 BAT1.MINUS 44.29,26.23 | D3.A 35.56,16.51 | 25.88,24.45 35.56,24.45 | 36.51,39.85 36.99,39.85 39.69,39.85 R5.1 39.69,39.69 45.09,39.69 | 45.09,39.69 45.09,37.31 45.09,36.67 | 45.09,33.81 45.09,32.7 48.9,32.7 48.9,35.16 MOD1.P$19 | 21.59,95.25 11.43,95.25 JP2-N.1 10.72,92.71 10.72,87.07 | 21.59,95.25 JP2-N.5 21.59,91.92 20.32,90.65 C10.2 | 21.59,95.25 25.72,95.25 25.72,91.12 24.45,89.85 24.45,88.11 24.45,87.37 IC4.1 IC4.2 IC4.3 IC4.4 34.92,87.37 38.04,87.37 v38.1,87.31 38.1,74.45 DZ1.A 35.24,74.14 | C4.1 v44.45,84.14 | USB1.P$2 3.31,23.34 6.03,23.34 USB1.GND 6.03,21.59 9.53,18.1 v15.56,18.1 20.8,18.1 20.8,19.21 25.88,19.21 25.88,20.95 | TR3.A 12.06,39.21 v12.06,37.31 | 6.59,79.69 3.17,79.69 3.17,73.66 4.76,73.66 | 4.76,73.66 14.29,73.66 | 14.29,73.66 JP3-F.4 | EXT.P2 4.76,66.83 4.76,73.66 | 25.56,23.81 21.27,23.81 21.27,23.18 | 21.27,23.18 25.72,23.18 | 25.88,24.29 25.88,20.95 | 44.29,26.23 44.29,21.59 43.73,22.15 TR2.A | 44.29,26.23 49.37,26.23 v49.37,26.19 | PIN_DC-.1 25.88,20.95 | C11.2 15.08,73.66 14.29,73.66 | 45.09,48.9 45.09,39.69 | T1.2 10.72,87.07 | R14.1 10.72,87.07 | 45.09,52.31 45.09,54.77 | 45.09,54.77 42.7,57.15 | 47.62,52.23 45.09,54.77
  Bottom 1.27: JP4-F.1 v36.2,57.15 42.7,57.15 | TR1.A 44.29,19.68 44.29,21.59
GND_SW
  Top 1.27: JP7-F.1 B3.1
  Bottom 1.27: JP7-F.1 B3.1
GPS_ZAP
  Top 1.016: PIN_R2.1 PIN_R.1
  Bottom 1.27: PIN_R.1 3.65,3.49
LED_RK
  Top 0.61: R10.1 42.86,69.22
  Top 1.016: R10.1 43.02,68.9 44.61,70.48 LED1.I
PA13_SWDIO
  Top 1.27: JP7-F.3 B5.1
  Bottom 1.27: JP7-F.3 B5.1
PA14_SWCLK
  Top 1.27: JP7-F.2 B4.1
  Bottom 1.27: JP7-F.2 B4.1
PIN_485_DERE  (via drill 0.7)
  Top 0.813: v33.81,48.26 23.18,48.26 19.21,44.29 v17.14,44.29 | 10.79,41.43 10.79,41.27
  Top 1.016: v11.43,41.43 10.79,41.43 MOD1.P$4
  Bottom 0.61: IC1.3 IC1.2 v33.81,48.26
  Bottom 0.813: v17.14,44.29 17.14,41.43 v11.43,41.43
PIN_485_RX_DI  (via drill 0.7)
  Bottom 0.61: IC1.4 36.35,47.78 33.66,50.48 MOD1.P$33
  Bottom 0.813: IC1.4 36.35,43.97 v36.2,43.97
PIN_485_TX_RO  (via drill 0.7)
  Bottom 0.61: 32.31,46.28 32.54,46.28 IC1.1
  Bottom 0.813: MOD1.P$32 v31.11,46.91 31.11,46.28 32.31,46.28
PIN_AD_BAT  (via drill 0.7)
  Top 0.813: R6.1 19.53,37.94 21.11,37.94 v21.11,37.78
  Top 1.016: v21.43,42.07 24.77,45.4 v38.73,45.4
  Bottom 0.61: v38.73,45.4 38.73,47.07 R8.2
  Bottom 0.813: v21.11,37.78 22.38,37.78 R7.1 | v38.73,45.4 MOD1.P$35 38.73,50.88
  Bottom 1.016: R7.1 22.38,41.12 v21.43,42.07
PIN_BZUK  (via drill 0.7)
  Top 0.61: 18.89,64.45 14.37,64.45 12.94,63.02 12.94,61.75
  Top 0.813: 19.61,71.68 12.78,78.5 v12.78,83.74
  Top 1.016: 19.61,71.68 19.61,64.45 18.89,64.45 | 12.94,61.75 12.94,56.67 10.32,56.67 10.32,50.56 MOD1.P$24
  Bottom 0.813: T1.1 12.79,82.24 R14.2 12.62,83.74 v12.78,83.74
PIN_DIS_CLK
  Bottom 0.813: JP3-F.1 17.14,61.44 8.89,61.44 8.89,56.52 5.4,53.02 1.59,53.02 1.59,35.24 3.17,35.24 MOD1.P$1
PIN_DIS_DIO  (via drill 0.7)
  Top 0.61: v10.16,44.29 10.16,44.21 3.49,44.21 3.49,37.94 5.71,35.72
  Top 0.813: 5.71,35.72 MOD1.P$2
  Top 1.016: v11.35,60.01 11.35,63.26 13.81,65.72 JP3-F.2
  Bottom 0.813: 9.53,48.9 9.53,52.07
  Bottom 1.016: v10.16,44.29 9.53,44.29 9.53,48.9 | 9.53,52.07 9.53,55.09 10.32,55.88 10.32,60.01 v11.35,60.01
PIN_NEO_LED  (via drill 0.7)
  Top 0.813: R10.2 38.97,66.91 v38.97,55.56
  Bottom 0.813: MOD1.P$34 36.2,51.28 37.78,52.86 38.34,52.86 38.97,53.5 v38.97,55.56
PIN_PB14  (via drill 0.7)
  Top 1.016: v11.59,58.26 9.84,58.26 9.84,64.14 12.06,66.36 12.06,73.74 6.99,73.74 EXT.P6
  Bottom 0.813: 12.06,48.9 12.06,52.07 | 8.26,35.72 MOD1.P$3
  Bottom 1.016: 12.06,48.9 12.06,42.86 10,42.86 10,37.47 8.26,35.72 | 12.06,52.07 13.65,53.66 13.65,58.26 v11.59,58.26
PIN_SCL  (via drill 0.7)  (1 unrouted)
  Top 0.61: 28.89,90.49 20.32,90.49 19.84,90.01 17.78,90.01 | v20.32,47.94 17.94,47.94 17.14,48.74 17.14,58.26 21.27,62.39 v21.27,66.99 | v25.08,40.64 34.13,40.64 36.2,38.58 MOD1.P$14 36.2,33.42 40.08,33.42 40.08,37.47 41.27,38.66 41.27,47.07 40.01,48.34 40.01,52.39 40.32,52.7 v40.32,58.82 | v17.94,76.68 v21.11,73.5
  Top 1.016: JP1-N.1 28.89,90.49 28.89,85.41 | 28.89,85.41 28.89,77.95 v28.57,77.95 | R20.1 28.89,85.41 | 17.78,90.81 17.78,90.01
  Bottom 0.61: 15.24,66.99 v21.27,66.99 21.75,66.99 21.75,69.85 | 21.75,69.85 21.75,73.5 | 21.75,73.5 21.75,77.95 v28.57,77.95 31.11,77.95 IC4.6 31.11,84.22 33.18,84.22 | v20.32,47.94 25.08,43.18 v25.08,40.64 | JP6-N.3 21.75,69.85 | IC5.6 17.3,78.42 17.94,77.79 v17.94,76.68 | v21.11,73.5 21.75,73.5 | IC6.8 37.78,58.82 v40.32,58.82
  Bottom 0.813: JP5-N.3 33.18,84.22
  Bottom 1.016: EXT.P3 12.38,69.37 14.76,66.99 15.24,66.99
PIN_SD_INS  (via drill 0.7)
  Top 0.813: MICRO_SD1.PADCD 38.48,73.72 34.92,70.17 v34.92,60.01
  Bottom 0.813: v34.92,60.01 15.56,60.01 15.56,54.53 15.56,53.02 15.56,50.56 MOD1.P$26
PIN_SDA  (via drill 0.7)  (1 unrouted)
  Top 0.61: v32.38,58.58 32.38,52.86 37.47,52.86 37.47,47.07 39.45,47.07 40.16,46.35 40.16,39.29 38.73,37.86 MOD1.P$15 | v23.81,76.2 20.95,76.2 v17.3,79.85 | v29.21,58.58 29.21,63.02 25.24,63.02 v23.81,64.45 v23.81,72.39
  Top 0.813: v29.37,76.2 30.6,77.43 30.6,87.95 | 30.6,87.95 30.6,91.16 31.43,92 JP1-N.2 | R19.1 30.68,88.03 30.6,87.95
  Top 1.016: JP1-N.2 31.43,95.25 17.78,95.25 17.78,94.77
  Bottom 0.61: v23.81,64.45 14.76,64.45 11.11,68.1 8.26,68.1 8.1,68.26 | v29.37,76.2 v23.81,76.2 v23.81,72.39 JP6-N.4 | v29.21,58.58 v32.38,58.58 36.43,58.58 36.43,64.21 39.05,64.21 IC6.7
  Bottom 0.813: v29.37,76.2 32.38,76.2 32.38,81.68 | 32.38,81.68 IC4.5 32.38,82.55 | IC5.5 17.3,79.69 v17.3,79.85 | JP5-N.4 32.38,81.68
  Bottom 1.016: EXT.P4 8.1,68.26
PIN_SPI_CS_SD
  Top 0.813: MICRO_SD1.PAD2 37.83,81.41 31.11,74.69 31.11,53.9 28.57,51.36 MOD1.P$31
PIN_SPI_MISO  (via drill 0.7)
  Top 0.61: 25.4,58.74 25.4,55.56
  Top 0.813: MICRO_SD1.PAD7 38.34,75.88 34.92,72.47 v34.92,72.39 | v26.19,61.28 26.19,59.53 25.4,58.74 | 25.4,55.56 25.4,55.24 24.37,54.21 24.37,51.44 MOD1.P$29
  Bottom 0.813: v34.92,72.39 34.92,61.28 v26.19,61.28
PIN_SPI_MOSI  (via drill 0.7)
  Top 0.61: 22.86,59.05 22.86,55.56
  Top 0.813: MICRO_SD1.PAD3 38.81,80.33 32.38,73.9 v32.38,62.55 | v24.13,61.75 22.86,60.48 22.86,59.05 | 22.86,55.56 22.86,53.66 20.95,51.75 MOD1.P$28
  Bottom 0.813: v32.38,62.55 24.92,62.55 v24.13,61.75
PIN_SPI_SCK  (via drill 0.7)
  Top 0.813: MICRO_SD1.PAD5 38.58,78.11 33.66,73.18 33.66,55.56 v33.81,55.56
  Bottom 0.813: v33.81,55.56 28.18,55.56 26.04,53.42 MOD1.P$30
PIN_TL_MINUS
  Bottom 0.813: 17.14,52.07 17.14,48.9
  Bottom 1.016: JP4-F.4 17.14,57.15 17.14,52.07 | 17.14,48.9 23.65,42.39 23.65,37.47 28.57,37.47 MOD1.P$11
PIN_TL_OK
  Bottom 0.813: 24.77,52.23 24.77,48.58 27.94,45.4 27.94,41.27 31.11,38.1
  Bottom 1.016: 24.77,52.23 24.77,53.98 24.13,54.61 JP4-F.2 | 31.11,38.1 MOD1.P$12
PIN_TL_PLUS  (via drill 0.7)
  Top 0.813: MOD1.P$10 26.51,35.32 v26.51,39.05
  Bottom 0.813: 22.23,52.07 22.23,48.9
  Bottom 1.016: JP4-F.3 21.59,52.7 22.23,52.07 | 22.23,48.9 26.51,44.61 v26.51,39.05
PRED_FUSE
  Top 0.813: 12.06,48.9 12.06,52.07
  Top 1.016: SW1.PIN_2 9.87,47.94 | 9.87,47.94 9.87,47.62 | 9.87,47.94 10.87,47.94 | 10.87,47.94 11.91,47.94 | 11.91,47.94 12.06,47.94 12.06,48.9 | 12.06,52.07 12.06,54.77 PIN_DC++.1 | B2.1 14.05,43.5 11.99,45.56 11.99,47.86 11.91,47.94 | F1.P$1 10.27,47.34 10.87,47.94
  Bottom 0.61: T3.3 3.97,47.94 SW1.PIN_2
REF_U  (via drill 0.7)
  Top 0.61: 20.32,58.74 20.32,55.24
  Top 0.813: v25.4,74.45 22.54,74.45 22.54,61.91 20.32,59.69 20.32,58.74 | MOD1.P$27 18.41,51.67 20.32,53.58
  Top 1.016: R9.1 v25.4,74.45 25.4,74.3 | 20.32,55.24 20.32,53.58
  Bottom 0.813: DZ1.K v25.4,74.45
RS485-A-IN
  Bottom 0.813: R2.1 45.09,8.49 K2.1
RS485-B-IN
  Bottom 0.813: 40.01,5.32 40.01,5.4 41.75,7.14 R1.1
  Bottom 1.016: K1.2 40.01,5.32
RS_485_A  (via drill 0.7)
  Bottom 0.406: R3.1 44.13,13.26
  Bottom 0.813: 42.55,33.5 42.55,38.26 35.08,38.26 IC1.6 35.08,42.39 | R4.1 35,44.13 35,42.39 35.08,42.39 | v36.2,42.39 35.08,42.39
  Bottom 1.016: 42.55,33.5 42.55,28.26 51.12,28.26 51.12,19.68 TR1.C 50.8,19.68 50.8,16.83 47.15,16.83 44.13,13.81 44.13,13.26 R2.2
RS_485_B  (via drill 0.7)
  Top 0.61: v42.55,43.5 42.55,32.38 38.58,32.38 37.62,31.43 v37.62,29.37
  Top 0.813: v37.62,24.61 v37.62,29.37
  Bottom 0.61: 33.81,37.31 33.81,37.23 34.92,37.23 34.92,32.38 36.75,32.38 37.62,31.51 v37.62,29.37
  Bottom 0.813: 33.81,37.31 IC1.7 33.81,42.31 v33.73,42.39 | R5.2 v42.55,43.5 | v37.62,24.61 37.62,23.08 39.15,23.08 | R3.2 41.75,13.41 41.75,13.26
  Bottom 1.016: 39.15,23.08 TR2.C 39.15,21.85 38.89,21.59 38.89,13.49 41.75,13.49 41.75,13.26 R1.2
RTC_INT  (via drill 0.7)
  Top 0.61: R15.2 v43.81,65.41
  Bottom 0.61: IC6.3 40.32,65.41 v43.81,65.41 44.62,65.41 T2.2
SERKOM_RX  (via drill 0.7)
  Top 0.61: IC3.2 12.06,27.15
  Top 0.813: 12.06,27.15 11.11,28.1 v11.11,29.53
  Bottom 1.016: v11.11,29.53 11.11,30.16 18.41,30.16 MOD1.P$7
SERKOM_TX  (via drill 0.7)
  Top 0.61: IC3.3 11.59,25.88 8.89,28.57 v7.46,28.57
  Bottom 0.61: 11.11,33.02 11.11,33.18 7.94,33.18 7.94,33.02
  Bottom 1.016: 11.11,33.02 15.88,33.02 MOD1.P$6 | 7.94,33.02 7.46,33.02 7.46,32.54 PIN_TX.1 v7.46,28.57
SUPCAP+
  Top 0.61: 40.08,27.94 40.01,27.94
  Top 0.813: 40.08,27.94 43.34,27.94 43.34,20.64 44.43,19.55 D7.A | 40.01,27.94 SUPCAP-DIRA.P$1
  Bottom 0.813: R11.1 40.01,27.94 SUPCAP-DIRA.P$1
T2_DRAIN  (via drill 0.7)
  Top 0.813: v46.83,61.91 45.4,61.91 R16.1
  Bottom 0.813: T2.3 46.83,63.18 v46.83,61.91
UBAT
  Bottom 1.27: K1.1 34.92,3.89 32.23,6.59 32.23,8.31 D2.A
USB_D+
  Top 0.61: 8.57,27.15 11.59,24.13 11.59,23.34 IC3.5
  Top 0.813: 8.57,27.15 6.03,27.15 USB1.D+
USB_D-
  Top 0.61: IC3.6 11.27,22.07 8.01,25.32 USB1.D-
V-USB-IN  (via drill 0.7)
  Top 0.813: v8.57,16.67 7.94,17.3 7.94,22.8 USB1.VBUS
  Top 1.016: v22.38,5.87 22.89,5.87 F2.P$2
  Bottom 0.813: v22.38,5.87 8.26,5.87 8.26,16.67 v8.57,16.67
VBAT  (via drill 0.7)
  Top 0.61: 45.09,48.26 45.09,54.77 43.97,55.88 43.97,60.17 v43.02,60.17 43.81,60.17 R15.1
  Top 0.813: D7.C 46.35,23.95 46.35,30.67 BAT1.PLUS2 | 45.09,30.64 45.09,36.67
  Top 1.016: BAT1.PLUS2 45.02,30.64 45.09,30.64 | 45.09,36.67 45.09,48.26 51.44,48.26 MOD1.P$40
  Bottom 0.61: IC6.6 40.32,64.21 43.02,64.21 43.02,62.23 | v43.02,60.17 43.02,62.23 | T2.1 43.02,62.23
VBUS-FUSE  (via drill 0.7)
  Top 0.61: IC2.5 12.15,15.56
  Top 0.813: 14.61,30.96 16.67,30.96 16.67,32.86 23.18,32.86 33.81,22.23 33.81,18.89 33.73,18.81 29.37,14.45 | D5.A 14.45,30.8 C3.1 14.61,30.96 | R13.2 8.41,7.14 | 14.61,37.31 14.61,30.96
  Top 1.016: 12.15,15.56 12.15,14.92 8.41,14.92 8.41,7.14 8.41,5 v8.97,4.45 | 33.73,18.81 28.26,13.34 28.26,9.68 28.23,9.68 F2.P$1 28.23,5.71 v30.48,5.71
  Top 1.422: D1.A 14.61,40.01 14.61,37.31
  Bottom 1.016: v8.97,4.45 24.29,4.45 25.24,5.4 28.87,5.4 29.19,5.71 | 29.19,5.71 D4.A | v30.48,5.71 29.19,5.71
VCC-CH340
  Top 0.813: IC3.16 21.41,28.42 D5.C
VIN  (via drill 0.7)
  Top 1.016: IC2.1 18.96,16.03 27.15,16.03 C1.C+ 27.3,25.72 v27.3,26.51 | v17.3,46.35 15.61,46.35 F1.P$2
  Bottom 0.813: 19.84,30.48 19.68,30.48 19.68,36.83
  Bottom 1.016: v27.3,26.51 27.3,30.48 19.84,30.48 | 19.68,36.83 19.68,39.21 | R7.2 19.68,39.85 19.68,39.21 | 19.68,39.21 TR3.C 19.53,39.21 19.53,44.13 v17.3,46.35
VIN_ON_OFF  (via drill 0.7)
  Top 0.813: 24.77,37.47 24.77,33.18 34.92,23.02 | PIN_DC+.1 37.47,19.05
  Top 1.016: 34.92,23.02 37.47,23.02 37.47,19.05 | SW1.PIN_COM 12.38,42.86 13.49,41.75 19.37,41.75 21.11,40.01 22.23,40.01 24.77,37.47
  Top 1.27: 37.47,19.05 v37.47,16.83
  Bottom 0.61: T3.2 3.02,41.12 R17.2 2.86,39.45 6.99,39.45 SW1.PIN_COM
  Bottom 0.813: D2.C 37.47,8.33 37.47,10.64
  Bottom 1.016: 37.47,8.36 37.47,10.64 v37.47,16.83 | B1.1 SW1.PIN_COM
XI  (via drill 0.7)
  Top 0.61: IC3.7 14.13,20.8 v15.24,21.91
  Bottom 0.813: C6.2 Q1.1
  Bottom 1.016: v15.24,21.91 17.46,21.91 17.46,26.35 C6.2
XO  (via drill 0.7)
  Top 0.61: IC3.8 v16.51,19.53
  Bottom 0.813: Q1.2 C7.1 19.21,21.27 19.21,19.53 v16.51,19.53
(copper drawn outside any net)
  shapes: Bottom circle x6, Top circle x6

### Text on the board
tPlace: G | B | D | G | V | C | D | I | V | G | Vin | C | 3V3 | GND | SCL | SDA | Micro SD / card | SDA | GND | SCL | 3V3 | GND | DIO | 3V3 | SQM-BAS | CLK | Ver: 7 | DATA_RDY | (STM32F411) | M | P | OK | G | DC++ | Tx | DC- | DC+ | X3V | XG | 3V3
bPlace: http://sqm.astromik.org | S | D | G | C' | D' | PB14 | 3V3 | I2C-EXT | SDA | SCL | GND | RDY | R' | S | D | E' | G | D | E | S | G | C | R | D | SCL | SDA | 3V3 | +BAT | B | A | GND
tDocu: Základní deska (ver. 7) pro SQM / TOP strana | Propojky C a D na konektoru JP2 provést / podle použitého modulu BME280
bDocu: Základní deska (ver. 7) pro SQM / BOT strana
t_nam_doc: JP10-F | JP11-F | BAT1 / SC1
Neosazovat_TOP: Nikdy se neosazují všechny součástky najednou. / Varianty osazení v přiložených dokumentech.
Neosazova_BOT: Nikdy se neosazují všechny součástky najednou. / Varianty osazení v přiložených dokumentech.